# EAGLE design doorEntryIoT (EAGLE 9.6.2)
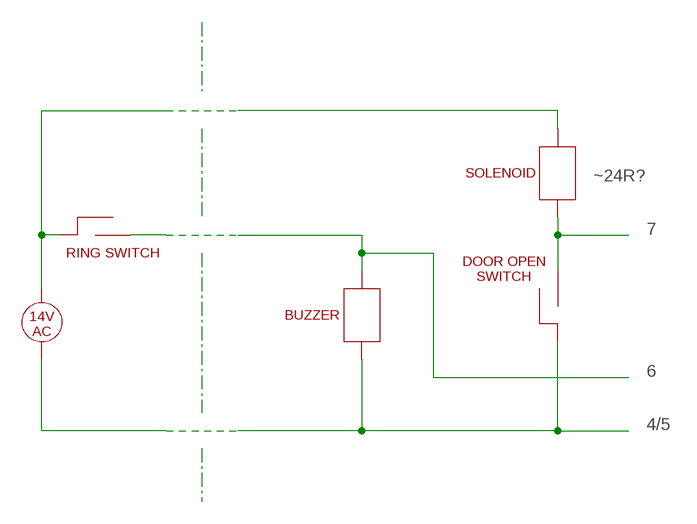
[diagram p0: schematic, sheet 1, part 1 of 2]
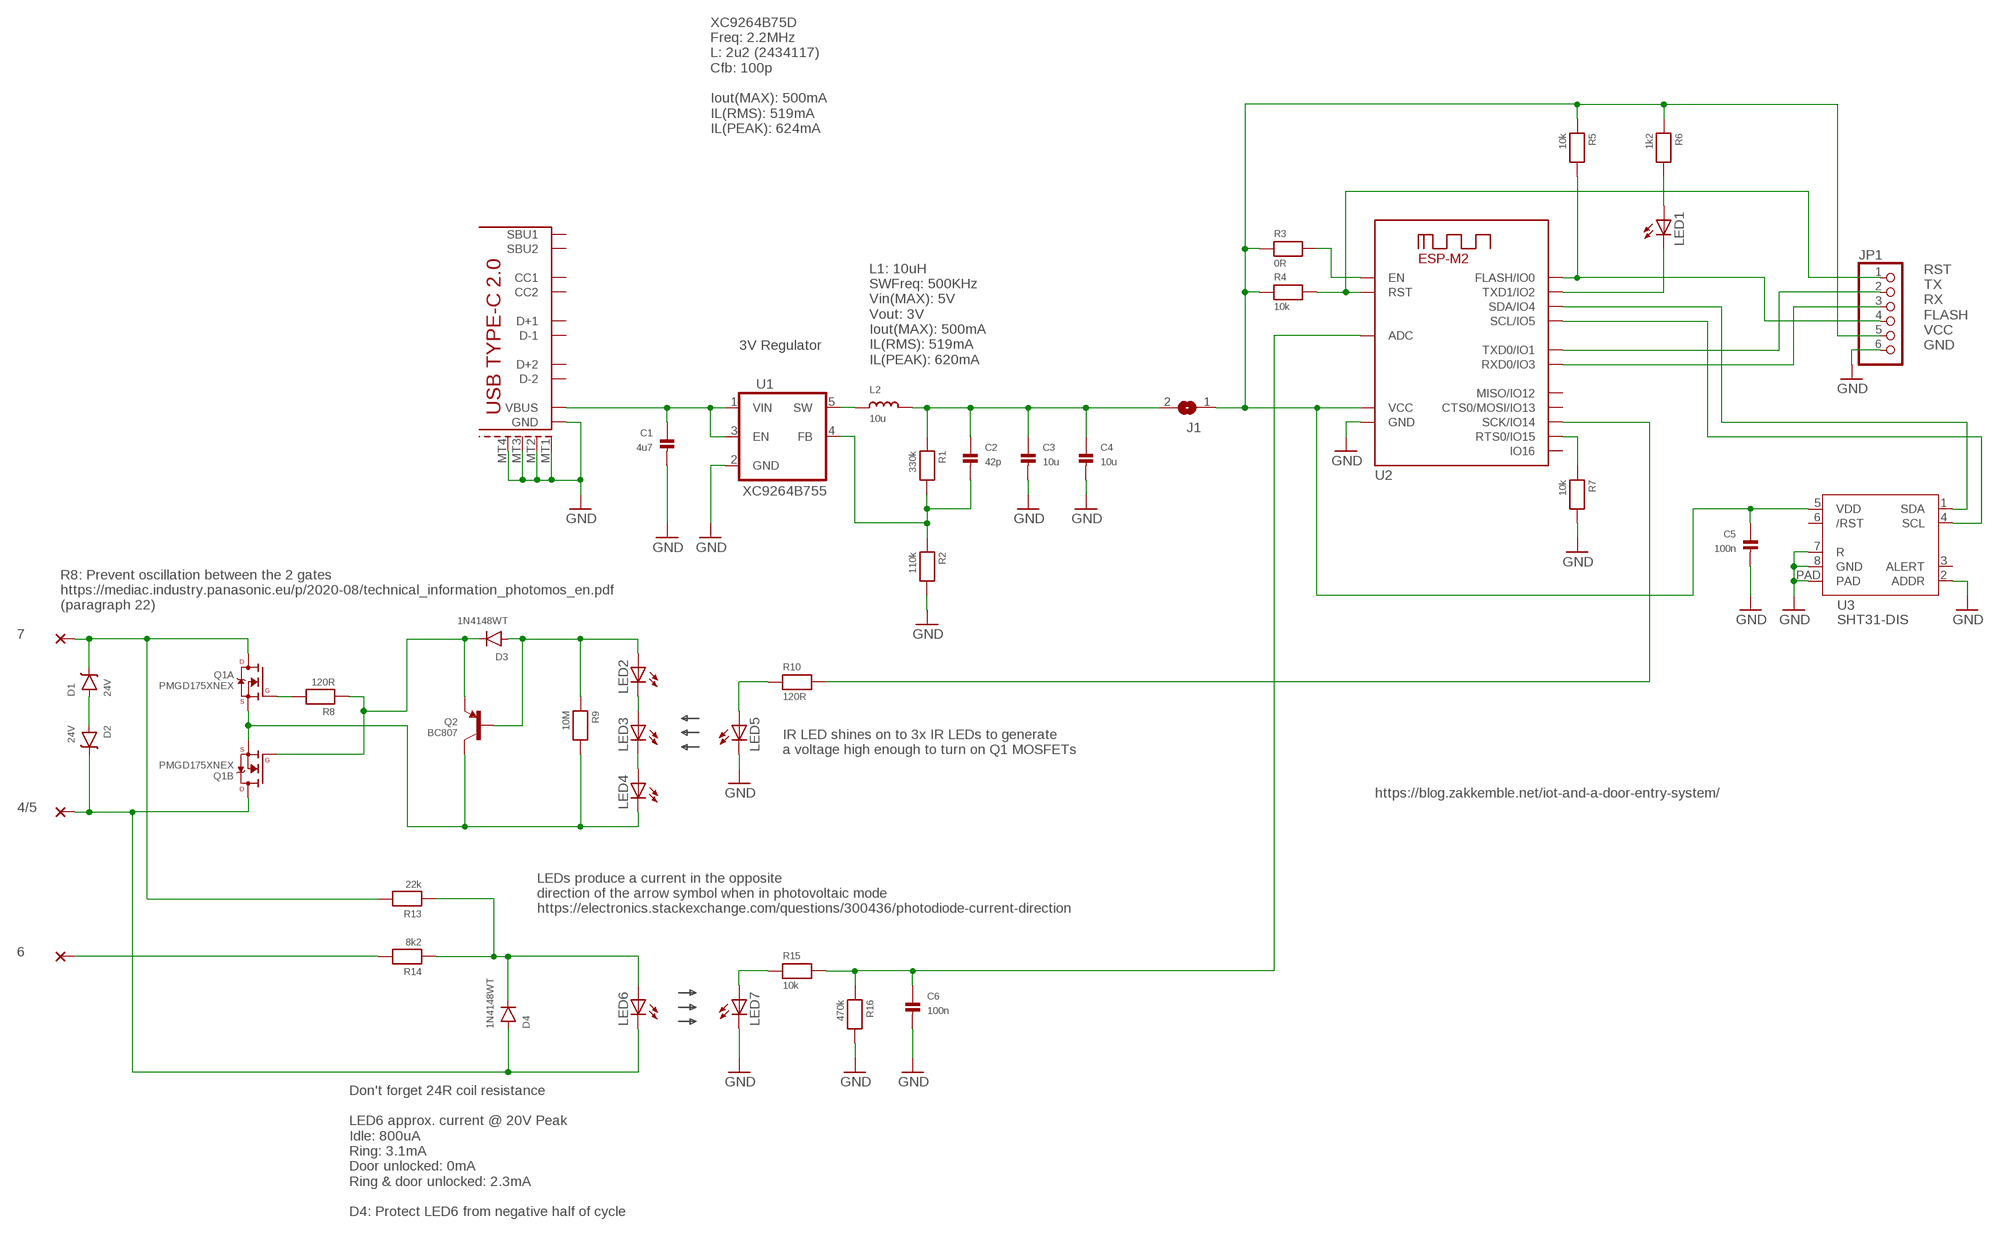
[diagram p1: schematic, sheet 1, part 2 of 2]

## Parts
C1  4u7  CAP_CERAMIC0805  [0805_NO_OUTLINE]
C2  42p  CAP_CERAMIC0402_XSMALL  [0402_XSMALL]
C3  10u  CAP_CERAMIC1206  [1206]
C4  10u  CAP_CERAMIC1206  [1206]
C5  100n  CAP_CERAMIC0402_XSMALL  [0402_XSMALL]
C6  100n  CAP_CERAMIC0402_XSMALL  [0402_XSMALL]
D1  24V  DIODE-ZENERSMA  [SMA]
D2  24V  DIODE-ZENERSMA  [SMA]
D3  1N4148WT  DIODESOD-523_SM  [SOD-523_SM]
D4  1N4148WT  DIODESOD-523_SM  [SOD-523_SM]
J1  JUMPERSMALL  [JUMPER_SMALL]
JP1  PINHD-1X6  [1X06]
L2  10u  INDUCTOR1210K  [1210K]
LED1  LED0402_XSMALL  [0402_DIODE_XSMALL]
LED2  LEDSIDEVIEW  [LED_SIDEVIEW]
LED3  LEDSIDEVIEW  [LED_SIDEVIEW]
LED4  LEDSIDEVIEW  [LED_SIDEVIEW]
LED5  LEDSIDEVIEW  [LED_SIDEVIEW]
LED6  LEDSIDEVIEW  [LED_SIDEVIEW]
LED7  LEDSIDEVIEW  [LED_SIDEVIEW]
PAD1  PADSMD-1.27X2  [PAD-SMD-1.27X2]
PAD2  PADSMD-1.27X2  [PAD-SMD-1.27X2]
PAD3  PADSMD-1.27X2  [PAD-SMD-1.27X2]
Q1  PMGD175XNEX  DUAL_NMOSFETSOT-363  [SOT-363]
Q2  BC807  TRANSISTOR_PNPSOT23-REFLOW  [SOT23-R]
R1  330k  RESISTOR0402_XSMALL  [0402_XSMALL]
R2  110k  RESISTOR0402_XSMALL  [0402_XSMALL]
R3  0R  RESISTOR0402_XSMALL  [0402_XSMALL]
R4  10k  RESISTOR0402_XSMALL  [0402_XSMALL]
R5  10k  RESISTOR0402_XSMALL  [0402_XSMALL]
R6  1k2  RESISTOR0402_XSMALL  [0402_XSMALL]
R7  10k  RESISTOR0402_XSMALL  [0402_XSMALL]
R8  120R  RESISTOR0402_XSMALL  [0402_XSMALL]
R9  10M  RESISTOR0402_XSMALL  [0402_XSMALL]
R10  120R  RESISTOR0402_XSMALL  [0402_XSMALL]
R13  22k  RESISTOR0402_XSMALL  [0402_XSMALL]
R14  8k2  RESISTOR1206  [1206]
R15  10k  RESISTOR0402_XSMALL  [0402_XSMALL]
R16  470k  RESISTOR0402_XSMALL  [0402_XSMALL]
U1  XC9264B755  SWITCH_REGCONFIG2  [SOT23-5_SM_PAD]
U2  ESP-M2  [ESP-M2]
U3  SHT31-DIS  SHT3X-DIS  [DFN_2.5X2.5_8]
USB1  USB-TYPE-C-2.0SMD  [USB-C-2.0_SMD]

## Nets
GND: C1.2 C3.2 C4.2 C5.2 C6.2 JP1.6 LED5.1(C) LED7.1(C) R2.2 R7.2 R16.2 U1.2(GND) U2.8(GND) U3.2(ADDR) U3.7(R) U3.8(GND) U3.PAD USB1.A1B2(GND) USB1.A12B1(GND) USB1.MT1(SHEILD1) USB1.MT2(SHEILD2) USB1.MT3(SHEILD3) USB1.MT4(SHEILD4)
N$1: R3.2 U2.2(EN)
N$2: D2.C D4.A LED6.1(C) PAD2.1 Q1.3(B:D)
N$3: R10.2 U2.3(SCK/IO14)
N$4: C1.1 U1.1(VIN) U1.3(EN) USB1.A4B9(VBUS) USB1.A9B4(VBUS)
N$5: U2.12(SCL/IO5) U3.4(SCL)
N$6: U2.11(SDA/IO4) U3.1(SDA)
N$8: Q1.2(A:G) R8.2
N$9: JP1.1 R4.2 U2.15(RST)
N$10: D3.K(C) Q1.5(B:G) Q2.2(E) R8.1
N$11: C5.1 J1.1 JP1.5 R3.1 R4.1 R5.1 R6.1 U2.7(VCC) U3.5(VDD)
N$12: C2.2 R1.2 R2.1 U1.4(FB)
N$13: L2.1 U1.5(SW)
N$14: LED5.2(A) R10.1
N$16: JP1.4 R5.2 U2.10(FLASH/IO0)
N$17: R7.1 U2.6(RTS0/IO15)
N$18: LED4.1(C) Q1.1(A:S) Q1.4(B:S) Q2.3(C) R9.2
N$19: LED2.1(C) LED3.2(A)
N$20: D1.A D2.A
N$21: LED1.2(C) U2.9(TXD1/IO2)
N$22: LED3.1(C) LED4.2(A)
N$23: JP1.2 U2.14(TXD0/IO1)
N$24: JP1.3 U2.13(RXD0/IO3)
N$25: LED1.1(A) R6.2
N$26: C6.1 R15.2 R16.1 U2.1(ADC)
N$27: D3.A LED2.2(A) Q2.1(B) R9.1
N$28: LED7.2(A) R15.1
N$30: D1.C PAD3.1 Q1.6(A:D) R13.2
N$31: D4.K(C) LED6.2(A) R13.1 R14.1
N$32: PAD1.1 R14.2
N$37: C2.1 C3.1 C4.1 J1.2 L2.2 R1.1
Unconnected: U2.4(MISO/IO12) U2.5(CTS0/MOSI/IO13) U2.16(IO16) U3.3(ALERT) U3.6(/RST) USB1.A5(CC1) USB1.A6(D+1) USB1.A7(D-1) USB1.A8(SBU1) USB1.B5(CC2) USB1.B6(D+2) USB1.B7(D-2) USB1.B8(SBU2)

## Notes on the sheet
- XC9264B75D
  Freq: 2.2MHz
  L: 2u2 (2434117)
  Cfb: 100p
  
  Iout(MAX): 500mA
  IL(RMS): 519mA
  IL(PEAK): 624mA
- 3V Regulator
- RST
  TX
  RX
  FLASH
  VCC
  GND
- L1: 10uH
  SWFreq: 500KHz
  Vin(MAX): 5V
  Vout: 3V
  Iout(MAX): 500mA
  IL(RMS): 519mA
  IL(PEAK): 620mA
- R8: Prevent oscillation between the 2 gates
  https://mediac.industry.panasonic.eu/p/2020-08/technical_information_photomos_en.pdf
  (paragraph 22)
- 7
- SOLENOID
- ~24R?
- IR LED shines on to 3x IR LEDs to generate
  a voltage high enough to turn on Q1 MOSFETs
- 7 | https://blog.zakkemble.net/iot-and-a-door-entry-system/
- RING SWITCH | 4/5
- DOOR OPEN
  SWITCH
- BUZZER
- 14V
  AC
- 6
- LEDs produce a current in the opposite
  direction of the arrow symbol when in photovoltaic mode
  https://electronics.stackexchange.com/questions/300436/photodiode-current-direction
- 4/5 | 6
- Don't forget 24R coil resistance
  
  LED6 approx. current @ 20V Peak
  Idle: 800uA
  Ring: 3.1mA
  Door unlocked: 0mA
  Ring & door unlocked: 2.3mA
  
  D4: Protect LED6 from negative half of cycle

## Library data of the parts
C1 C2 C5 C6 = zak:CAP_CERAMIC
C3 C4 = zak:CAP_CERAMIC; FARNELL: 9227881,1828814; FARNELL_ALT: 1288204,1463362,2611941
D1 D2 = zak:DIODE-ZENER; FARNELL: 1431151
D3 D4 = zak:DIODE: Diode in 0805 package
J1 = zak:JUMPER
JP1 = zak-headers:PINHD-1X6
L2 = zak:INDUCTOR; FARNELL: 1463485; FARNELL_ALT: 2219275
LED1 = zak:LED
LED2-LED7 = zak:LED; FARNELL: 2426200
PAD1-PAD3 = zak:PAD
Q1 = zak:DUAL_NMOSFET; FARNELL: 3440057
Q2 = microbuilder:TRANSISTOR_PNP: PNP Transistor Transistor (PNP) 800mA 60V, 1.6V VCE @ 500mA [Digikey: MMBT2907AFSTR-ND] Transistor (PNP) Low Sat - 1.5A 20V, 260mV VCE @ 400mA [Digikey: ZXTP25020DFLTR-ND] SOT23-R - SOT23 footprint optimised for use with solder paste and reflow ovens. SOT23-W - SOT23 footprint optimised for hand-soldering (larger pads).
R1-R10 R13 R15 R16 = zak:RESISTOR
R14 = zak:RESISTOR; FARNELL: 1577394
U1 = zak:SWITCH_REG; FARNELL: 3535735
U2 = zak:ESP-M2
U3 = zak:SHT3X-DIS
USB1 = zak:USB-TYPE-C-2.0

## Board
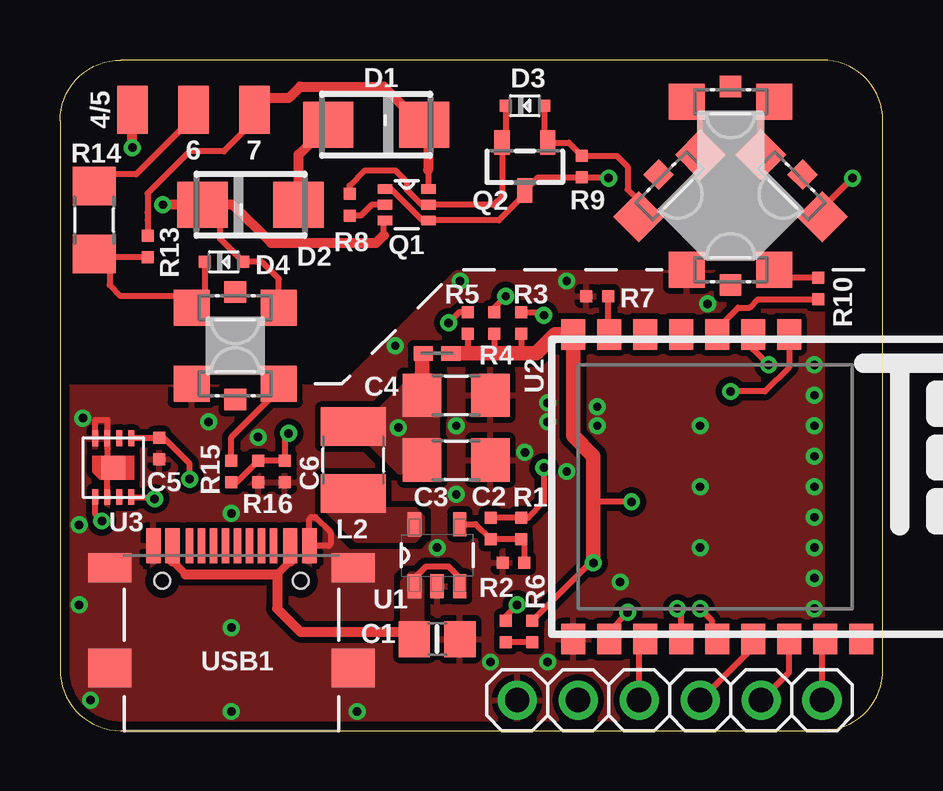
[diagram p2: board, top side]
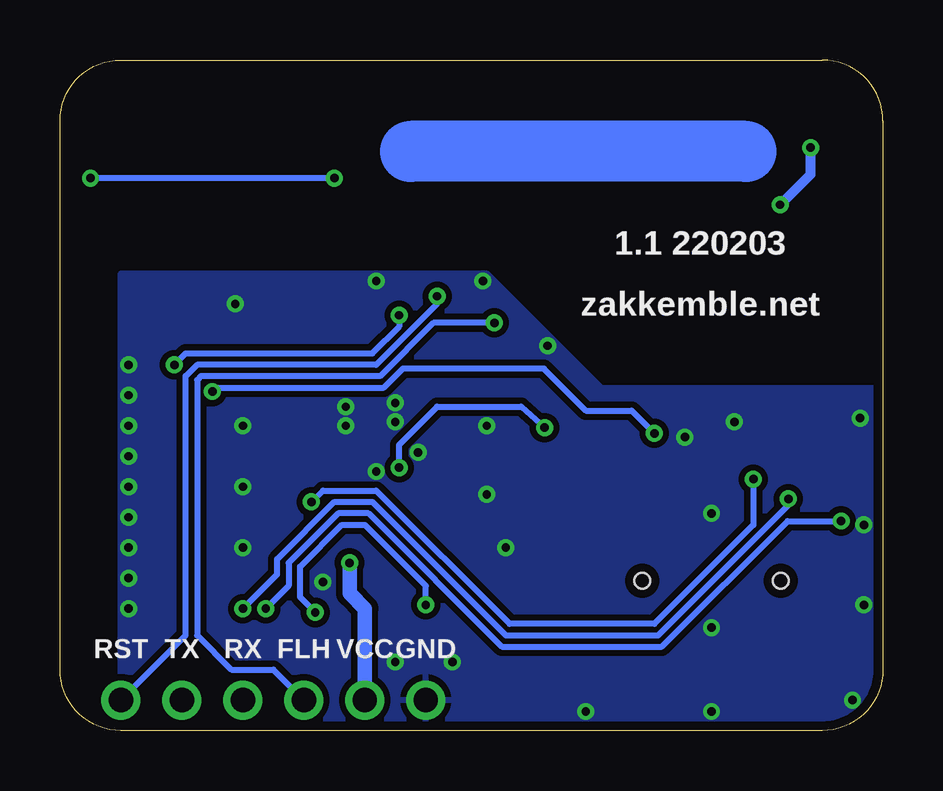
[diagram p3: board, bottom side, seen from below]

Size 34.29 x 27.94 mm. Coordinates in mm from the lower left corner, seen from the top.
Outline: 0,2.54 arc90 2.54,0 31.75,0 arc90 34.29,2.54 34.29,25.4 arc90 31.75,27.94 2.54,27.94 arc90 0,25.4 0,2.54
Copper layers (1*16): Top 0.0356mm / dielectric 1.5011mm / Bottom 0.0356mm
Design rules "LaenPCBOrder *": minimum track width 6mil, minimum drill 13mil, track to track 6mil, track to pad 6mil, pad to pad 6mil, via to via 6mil, smd to smd 6mil, copper to edge 15mil, drill to drill 6mil, minimum pad ring 12mil, minimum via ring 7mil, stop-mask expansion 4mil, vias tented up to drill 24mil, thermal gap 10mil

### Footprints (pad centres in the part's own frame; a part is rotated, then mirrored left to right if it is on the bottom)
0805_NO_OUTLINE = smd 1.3 x 1.5: 1 -0.95,0; 2 0.95,0
0402_XSMALL = smd 0.5 x 0.5: 1 -0.45,0; 2 0.45,0
1206 = smd 1.6 x 1.803: 1 -1.422,0; 2 1.422,0
SMA = smd 2.1 x 1.9: A 2,0; C -2,0
SOD-523_SM = smd 0.5 x 0.5: A 0,-0.8; K 0,0.8
JUMPER_SMALL = smd 0.8 x 0.6: 1 -0.577,0; 2 0.577,0
1X06 = drill 1.016: 1 -6.35,0; 2 -3.81,0; 3 -1.27,0; 4 1.27,0; 5 3.81,0; 6 6.35,0
1210K = smd 1.6 x 2.7: 1 -1.4,0; 2 1.4,0
0402_DIODE_XSMALL = smd 0.5 x 0.5: 1 -0.45,0; 2 0.45,0
LED_SIDEVIEW = smd 1.5 x 1.5: 1 -1.82,0; 2 1.82,0 | smd 0.9 x 0.9: 3 0,-0.65
PAD-SMD-1.27X2 = smd 1.27 x 2: 1 0,0
SOT-363 = smd 0.6 x 0.4: 1 -0.9,0.65; 2 -0.9,0; 3 -0.9,-0.65; 4 0.9,-0.65; 5 0.9,0; 6 0.9,0.65
SOT23-R = smd 0.635 x 1.016: 1 -0.95,-1; 2 0.95,-1; 3 0,1
SOT23-5_SM_PAD = smd 1 x 0.56: 1 -1.295,0.94; 2 -1.295,0; 3 -1.295,-0.94; 4 1.295,-0.94; 5 1.295,0.94
ESP-M2 = smd 1.27 x 1: 1 -6.35,-0.1; 2 -6.35,-1.6; 3 -6.35,-3.1; 4 -6.35,-4.6; 5 -6.35,-6.1; 6 -6.35,-7.6; 7 -6.35,-9.1; 8 6.35,-9.1; 9 6.35,-7.6; 10 6.35,-6.1; 11 6.35,-4.6; 12 6.35,-3.1; 13 6.35,-1.6; 14 6.35,-0.1; 15 6.35,1.4; 16 6.35,2.9
DFN_2.5X2.5_8 = smd 0.65 x 0.25: 1 -1.225,0.75; 2 -1.225,0.25; 3 -1.225,-0.25; 4 -1.225,-0.75; 5 1.225,-0.75; 6 1.225,-0.25; 7 1.225,0.25; 8 1.225,0.75 | smd 1 x 1: PAD 0,0
USB-C-2.0_SMD = smd 0.6 x 1.45: A1B2 -3.25,7.695; A4B9 -2.45,7.695; A9B4 2.45,7.695; A12B1 3.25,7.695 | smd 0.3 x 1.45: A5 -1.25,7.695; A6 -0.25,7.695; A7 0.25,7.695; A8 1.25,7.695; B5 1.75,7.695; B6 0.75,7.695; B7 -0.75,7.695; B8 -1.75,7.695 | smd 1.8 x 1.6: MT1 -5.07,2.6; MT2 5.07,2.6 | smd 1.8 x 1.2: MT3 -5.07,6.78; MT4 5.07,6.78 | hole 0.65: -2.89,6.25; 2.89,6.25

### Placement (x,y rotation side)
C1  15.72,3.81 0 top
C2  17.94,8.41 270 top
C3  16.51,11.27 0 top
C4  16.51,13.97 0 top
C5  4.13,11.75 270 top
C6  9.37,10.8 270 top
D1  13.18,25.24 180 top
D2  7.94,21.91 0 top
D3  19.37,26.03 90 top
D4  6.83,19.53 90 top
J1  15.72,15.72 180 top
JP1  25.4,1.27 180 top
L2  12.22,11.27 90 top
LED1  18.57,4.13 90 top
LED2  25.4,22.7 225 top
LED3  27.94,26.19 180 top
LED4  30.48,22.7 135 top
LED5  27.94,19.21 0 top
LED6  7.3,17.62 180 top
LED7  7.3,14.45 0 top
PAD1  5.56,25.88 0 top
PAD2  3.02,25.88 0 top
PAD3  8.1,25.88 0 top
Q1  14.45,21.91 0 top
Q2  19.37,23.49 180 top
R1  19.21,8.41 270 top
R2  18.89,6.98 180 top
R3  19.21,16.99 90 top
R4  18.1,16.99 90 top
R5  16.99,16.99 90 top
R6  19.69,4.13 270 top
R7  22.38,18.1 180 top
R8  12.06,21.91 270 top
R9  21.75,23.49 270 top
R10  31.59,18.41 270 top
R13  3.65,20.16 90 top
R14  1.43,21.27 90 top
R15  7.14,10.8 270 top
R16  8.25,10.8 270 top
U1  15.72,7.3 90 top
U2  30.48,10.16 270 top
U3  2.22,10.95 90 top
USB1  7.14,0 0 top

### Tracks (layer width: path | path; a pad name or v marks a point on that pad's centre or on a via)
GND  (via drill 0.35)
  Top 0.254: U3.2 1.97,10.7 U3.PAD 1.97,11.2 U3.7 1.97,12.95 1.47,12.95 1.47,12.81 1.47,12.79 U3.8 | USB1.A12B1 10.39,8.81 10.48,8.89 10.64,8.89 11.27,8.25 11.27,7.78 11.19,7.69 USB1.A12B1
  other vias: 17.94,2.86 26.99,17.78 16.51,9.84 19.37,11.59 16.51,12.7 20.32,2.86 22.38,12.7 16.67,18.73 31.43,13.97 15.72,7.62 31.43,5.08 31.43,6.35 31.43,7.62 31.43,8.89 31.43,10.16 31.43,11.43 31.43,12.7 0.95,13.02 1.27,1.27 7.14,0.79 7.14,4.29 12.38,0.79 7.14,9.05 0.79,5.24 0.79,8.57 6.19,12.86 8.25,12.22 21.11,18.73 26.67,10.16 26.67,7.62 26.67,12.7 22.38,13.49 20.32,13.65 20.32,12.86 23.34,6.19 21.11,10.8 13.97,16.03 31.43,15.24
  pour Bottom (isolate 0.254, rank 6): 31.75,19.05 16.51,19.05 11.75,14.29 0,14.29 0,0 31.75,0
  pour Top (isolate 0.254, rank 6): 31.75,19.05 16.51,19.05 11.75,14.29 0,14.29 0,0 31.75,0
  pour Top (isolate 0.254, rank 5, no thermals): 0.79,3.65 3.33,3.65 3.33,1.59 0.79,1.59
  pour Top (isolate 0.254, rank 5, no thermals): 10.95,3.65 13.49,3.65 13.49,1.59 10.95,1.59
  pour Top (isolate 0.254, rank 5, no thermals): 0.79,7.78 3.17,7.78 3.17,5.71 0.79,5.71
  pour Top (isolate 0.254, rank 6, no thermals): 11.11,7.78 13.49,7.78 13.49,5.71 11.11,5.71
N$1  (via drill 0.35)
  Top 0.254: R3.2 20.03,17.44 v20.16,17.3 | v29.53,15.24 28.88,15.89 U2.2
  Bottom 0.254: v20.16,17.3 20.16,16.83 21.27,15.72 29.05,15.72 v29.53,15.24
N$2  (via drill 0.35)
  Top 0.254: 13.49,20.64 13.49,21.2 Q1.3 | D2.C 6.03,21.91 6.67,21.27 6.67,20.48 D4.A 8.41,19.53 9.12,18.82 LED6.1
  Top 0.406: v4.29,21.91 D2.C 7.21,21.91 8.79,20.32 13.18,20.32 13.49,20.64 | v3.02,24.29 PAD2.1
  Bottom 0.406: v4.29,21.91 3.02,23.18 v3.02,24.29
N$3
  Top 0.254: U2.3 27.38,16.74 28.26,17.62 28.73,17.62 29.08,17.97 R10.2
N$4
  Top 0.254: U1.3 16.66,6.36 16.19,6.83 15.24,6.83 14.78,6.36 U1.1
  Top 0.305: 9.59,7.05 9.05,6.51 | 4.69,7.05 5.24,6.51
  Top 0.406: USB1.A9B4 9.59,7.05 | C1.1 14.45,4.13 10,4.13 9.05,5.08 9.05,6.51 5.24,6.51 | USB1.A4B9 4.69,7.05
  pour Top (isolate 0.254, rank 5, no thermals): 14.6,6.51 14.29,6.19 14.29,4.44 14.45,4.29 14.92,4.29 15.08,4.44 15.08,6.19 14.76,6.51
N$5  (via drill 0.35)
  Top 0.254: U2.12 27.15,4.04 27.15,4.6 v26.67,5.08 | U3.4 3.86,9.73 v3.94,9.65
  Bottom 0.254: v26.67,5.08 25.24,6.51 25.24,7.14 22.86,9.52 21.27,9.52 15.72,3.97 9.37,3.97 3.94,9.39 v3.94,9.65
N$6  (via drill 0.35)
  Top 0.254: U2.11 25.88,4.92 v25.72,5.08 | v1.75,8.73 1.47,9 U3.1
  Bottom 0.254: v25.72,5.08 24.77,6.03 24.77,6.98 22.7,9.05 21.43,9.05 15.88,3.49 9.21,3.49 3.97,8.73 v1.75,8.73
N$7
  Bottom 2.54: 5.71,24.13 19.69,24.13
N$8
  Top 0.254: Q1.2 12.99,21.91 12.54,21.46 R8.2
N$9  (via drill 0.35)
  Top 0.254: JP1.1 31.75,3.68 U2.15 | R4.2 18.1,17.62 v18.57,18.1
  Bottom 0.254: v18.57,18.1 18.57,17.78 21.11,15.24 28.57,15.24 29.05,14.76 29.05,3.97 JP1.1
N$10
  Top 0.254: Q2.2 18.42,24.13 | 18.42,24.13 18.42,22.27 18.05,21.91 Q1.5 15.08,21.91 14.45,22.54 14.45,22.86 13.97,23.34 12.7,23.34 12.06,22.7 R8.1 | D3.K 18.57,24.28 18.42,24.13
N$11  (via drill 0.35)
  Top 0.254: R3.1 19.21,15.72 | v23.81,9.52 22.23,9.52 | v5.4,10.48 5.4,11.11 4.31,12.2 C5.1 4.11,12.18 U3.5 | R5.1 16.99,15.88 16.83,15.72 | R4.1 18.1,15.72 | R6.1 22.09,6.98 v22.23,6.98
  Top 0.61: v22.23,6.98 22.23,9.52 22.23,11.43 21.38,12.27 U2.7 20.64,16.51 19.84,15.72 19.21,15.72 18.1,15.72 16.83,15.72 J1.1
  Bottom 0.254: v5.4,10.48 5.4,8.57 9.52,4.44 15.56,4.44 21.11,10 23.34,10 v23.81,9.52
  Bottom 0.61: JP1.5 21.59,5.08 22.23,5.71 v22.23,6.98
N$12
  Top 0.254: R2.1 19.34,7.8 19.21,7.94 R1.2 C2.2 17.3,8.6 U1.4
N$13
  pour Top (isolate 0.254, rank 5, no thermals): 12.38,7.94 11.19,9.13 11.27,9.21 14.76,9.21 15.08,8.89 15.08,8.25 14.76,7.94
N$14
  Top 0.254: R10.1 30.1,18.86 LED5.2
N$16  (via drill 0.35)
  Top 0.254: JP1.4 24.13,3.56 U2.10 | R5.2 16.64,17.44 v16.19,16.99
  Bottom 0.254: v16.19,16.99 18.73,16.99 20.95,14.76 28.42,14.76 28.57,14.6 28.57,3.97 27.15,2.54 25.4,2.54 JP1.4
N$17
  Top 0.254: U2.6 22.83,16.56 R7.1
N$18  (via drill 0.35)
  Top 0.254: Q1.1 13.8,22.56 15.1,21.26 Q1.4 18.29,21.26 19.37,22.34 Q2.3 19.92,23.05 R9.2 22.83,23.05 v22.86,23.02 | v33.02,23.02 31.77,21.77 LED4.1
  Bottom 0.254: v22.86,23.02 v33.02,23.02
N$19
  Top 0.254: LED2.1 26.69,25.63 LED3.2
N$20
  Top 0.406: D2.A 9.94,24 D1.A
N$21  (via drill 0.35)
  Top 0.254: U2.9 22.88,4.15 v23.65,4.92 | LED1.2 18.57,4.76 v19.05,5.24
  Bottom 0.254: v19.05,5.24 19.05,6.03 21.59,8.57 22.54,8.57 24.29,6.83 24.29,5.56 v23.65,4.92
N$22
  Top 0.254: LED4.2 29.19,25.63 LED3.1
N$23
  Top 0.254: JP1.2 30.38,2.44 U2.14
N$24
  Top 0.254: U2.13 28.88,3.48 JP1.3
N$25
  Top 0.254: R6.2 LED1.1
N$26  (via drill 0.35)
  Top 0.254: U2.1 30.38,15.14 29.37,14.13 v27.94,14.13 | v9.52,12.38 9.37,12.22 C6.1 R16.1 7.36,10.34 R15.2
  Bottom 0.254: v27.94,14.13 27.78,14.29 20.8,14.29 20,15.08 14.13,15.08 12.38,13.33 10.48,13.33 v9.52,12.38
N$27
  Top 0.254: D3.A 20.17,24.64 Q2.1 21.2,24.49 R9.1 23.2,23.94 23.65,23.49 23.65,22.54 24.13,22.07 24.13,21.43 LED2.2
N$28
  Top 0.254: R15.1 7.14,12.22 9.12,14.2 LED7.2
N$30
  Top 0.254: PAD3.1 8.1,25.4 6.83,24.13 5.4,24.13 3.65,22.38 3.65,21.59 3.65,21.27 R13.2 | 15.13,25.19 D1.C | Q1.6 15.35,23.35 15.34,23.36
  Top 0.406: PAD3.1 8.57,26.35 9.52,26.35 10,26.83 13.49,26.83 15.13,25.19 | D1.C 15.34,25.08 15.34,23.36
N$31
  Top 0.254: D4.K 6.03,18.16 LED6.2 5.01,18.1 2.53,18.1 2.06,18.57 2.06,19.22 R14.1 1.57,19.71 R13.1
N$32
  Top 0.254: R14.2 1.9,23.17 3.17,23.17 5.56,25.56 PAD1.1
N$37  (via drill 0.35)
  Top 0.254: C2.1 R1.1 19.5,8.86 20.16,9.52 v20.16,10.95
  Top 0.61: C4.1 15.09,15.66 J1.2
  Bottom 0.254: v20.16,10.95 20.16,11.91 18.57,13.49 15.08,13.49 v14.1,12.62
  pour Top (isolate 0.254, rank 5, no thermals): 14.13,10.8 15.56,10.8 15.72,10.95 15.72,14.45 15.4,14.76 14.76,14.76 12.86,12.86 12.86,12.06

### Text on the board
tPlace: 4/5 | 6 | 7
bPlace: 1.1 220203 | zakkemble.net | GND | VCC | FLH | RX | TX | RST
bStop: Door Entry IoT